# EAGLE design eagle exp 2 (EAGLE 9.6.2)
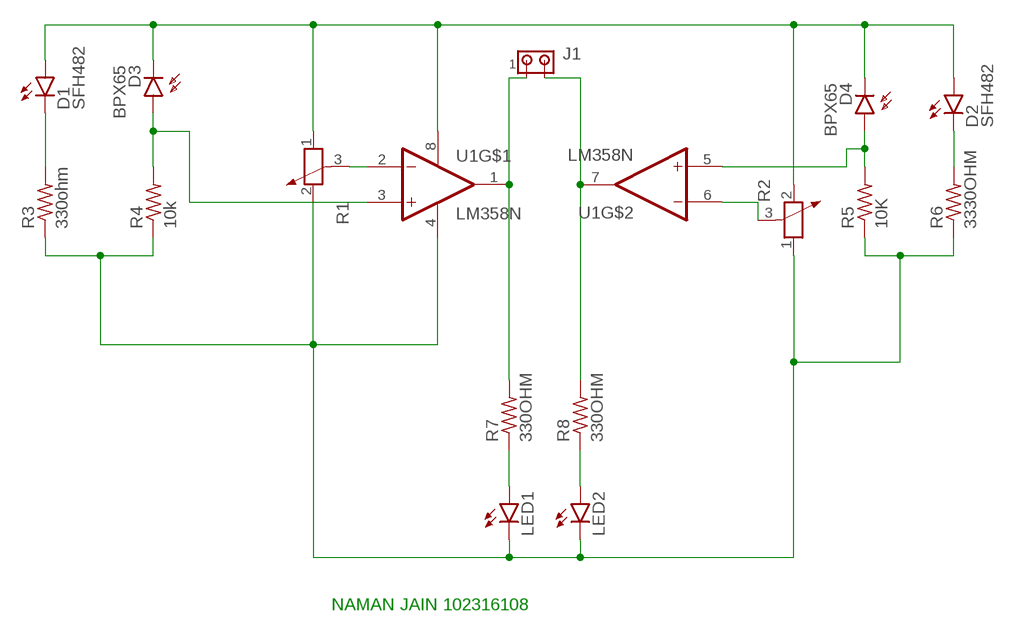
[diagram p0: schematic, sheet 1]

## Parts
D1  SFH482  [SFH482]
D2  SFH482  [SFH482]
D3  BPX65  [BPX65]
D4  BPX65  [BPX65]
J1  MTA02-100  [10X02MTA]
LED1  LED3MM  [LED3MM]
LED2  LED3MM  [LED3MM]
R1  POTENTIOMETER_PT-10  [PT-10]
R2  POTENTIOMETER_PT-10  [PT-10]
R3  330ohm  R-US_0204/5  [0204/5]
R4  10k  R-US_0204/5  [0204/5]
R5  10K  R-US_0204/5  [0204/5]
R6  3330OHM  R-US_0204/5  [0204/5]
R7  330OHM  R-US_0204/5  [0204/5]
R8  330OHM  R-US_0204/5  [0204/5]
U1  LM358N  [DIP762W46P254L960H508Q8]

## Nets
N$1: R1.3 U1.2(1IN-)
N$2: D1.K(C) R3.2
N$3: D2.K(C) R6.2
N$4: D4.A R5.2 U1.5(2IN+)
N$5: LED1.K(C) LED2.K(C) R1.2 R2.1 R3.1 R4.1 R5.1 R6.1 U1.4(GND)
N$6: R2.3 U1.6(2IN-)
N$7: D1.A D2.A D3.K(C) D4.K(C) R1.1 R2.2 U1.8(VCC)
N$8: J1.1 R7.2 U1.1(1OUT)
N$9: J1.2 R8.2 U1.7(2OUT)
N$10: LED1.A R7.1
N$11: LED2.A R8.1
N$13: D3.A R4.2 U1.3(1IN+)

## Notes on the sheet
- NAMAN JAIN 102316108

## Library data of the parts
D1 D2 = led:SFH482: IR LED infrared emitting diode, Infineon
D3 D4 = opto-trans-siemens:BPX65: PHOTO DIODE; MPN: BPX65.; OC_FARNELL: 327451; OC_NEWARK: 06WX2764
J1 = con-amp:MTA02-100: AMP connector
LED1 LED2 = led:LED: LED OSRAM: - CHIPLED LG R971, LG N971, LY N971, LG Q971, LY Q971, LO R971, LY R971 LH N974, LH R974 LS Q976, LO Q976, LY Q976 LO Q996 - Hyper CHIPLED LW Q18S LB Q993, LB Q99A, LB R99A - SideLED LS A670, LO A670, LY A670, LG A670, LP A670 LB A673, LV A673, LT A673, LW A673 LH A674 LY A675 LS A676, LA A676, LO A676, LY A676, LW A676 LS A679, LY A679, LG A679 - Hyper Micro SIDELED® LS Y876, LA Y876, LO Y876, LY Y876 LT Y87S - SmartLED LW L88C, LW L88S LB L89C, LB L89S, LG L890 LS L89K, LO L89K, LY L89K LS L896, LA L896, LO L896, LY L896 - TOPLED LS T670, LO T670, LY T670, LG T670, LP T670 LSG T670, LSP T670, LSY T670, LOP T670, LYG T670 LG T671, LOG T671, LSG T671 LB T673, LV T673, LT T673, LW T673 LH T674 LS T676, LA T676, LO T676, LY T676, LB T676, LH T676, LSB T676, LW T676 LB T67C, LV T67C, LT T67C, LS T67K, LO T67K, LY T67K, LW E67C LS E67B, LA E67B, LO E67B, LY E67B, LB E67C, LV E67C, LT E67C LW T67C LS T679, LY T679, LG T679 LS T770, LO T770, LY T770, LG T770, LP T770 LB T773, LV T773, LT T773, LW T773 LH T774 LS E675, LA E675, LY E675, LS T675 LS T776, LA T776, LO T776, LY T776, LB T776 LHGB T686 LT T68C, LB T68C - Hyper Mini TOPLED® LB M676 - Mini TOPLED Santana® LG M470 LS M47K, LO M47K, LY M47K Source: http://www.osram.convergy.de LUXEON: - LUMILED® LXK2-PW12-R00, LXK2-PW12-S00, LXK2-PW14-U00, LXK2-PW14-V00 LXK2-PM12-R00, LXK2-PM12-S00, LXK2-PM14-U00 LXK2-PE12-Q00, LXK2-PE12-R00, LXK2-PE12-S00, LXK2-PE14-T00, LXK2-PE14-U00 LXK2-PB12-K00, LXK2-PB12-L00, LXK2-PB12-M00, LXK2-PB14-N00, LXK2-PB14-P00, LXK2-PB14-Q00 LXK2-PR12-L00, LXK2-PR12-M00, LXK2-PR14-Q00, LXK2-PR14-R00 LXK2-PD12-Q00, LXK2-PD12-R00, LXK2-PD12-S00 LXK2-PH12-R00, LXK2-PH12-S00 LXK2-PL12-P00, LXK2-PL12-Q00, LXK2-PL12-R00 Source: www.luxeon.com KINGBRIGHT: KA-3528ASYC Source: www.kingbright.com
R1 R2 = rcl:POTENTIOMETER_: Potentiometer; SPICEMODEL: POT; SPICEPREFIX: X
R3-R8 = rcl:R-US_: RESISTOR, American symbol; SPICEPREFIX: R
U1 = LM358N:LM358N: IC OPAMP GP 2 CIRCUIT 8DIP Check availability <https://pricing.snapeda.com/parts/LM358N/Harris%20Corporation/view-part?ref=eda>; AVAILABILITY: Not in stock; CHECK_PRICES: https://www.snapeda.com/parts/LM358N/Harris/view-part/?ref=eda; DESCRIPTION: General Purpose Amplifier 2 Circuit 8-PDIP; MF: Harris Corporation; MP: LM358N; PACKAGE: None; PRICE: None; SNAPEDA_LINK: https://www.snapeda.com/parts/LM358N/Harris/view-part/?ref=snap

## Board
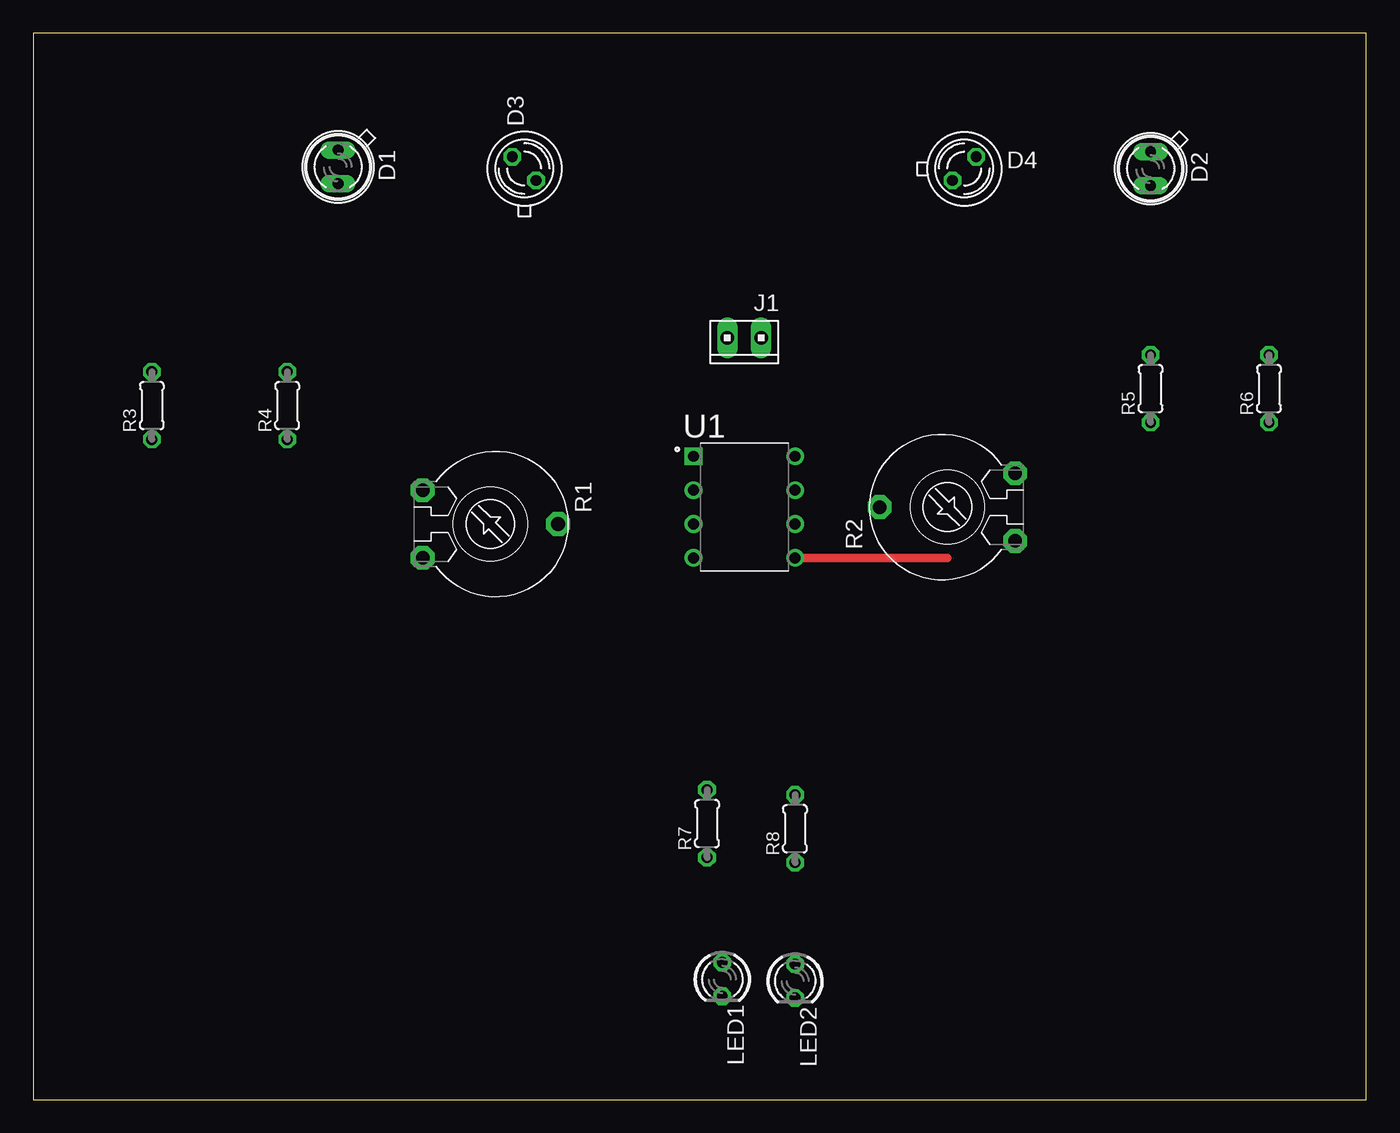
[diagram p1: board, top side]
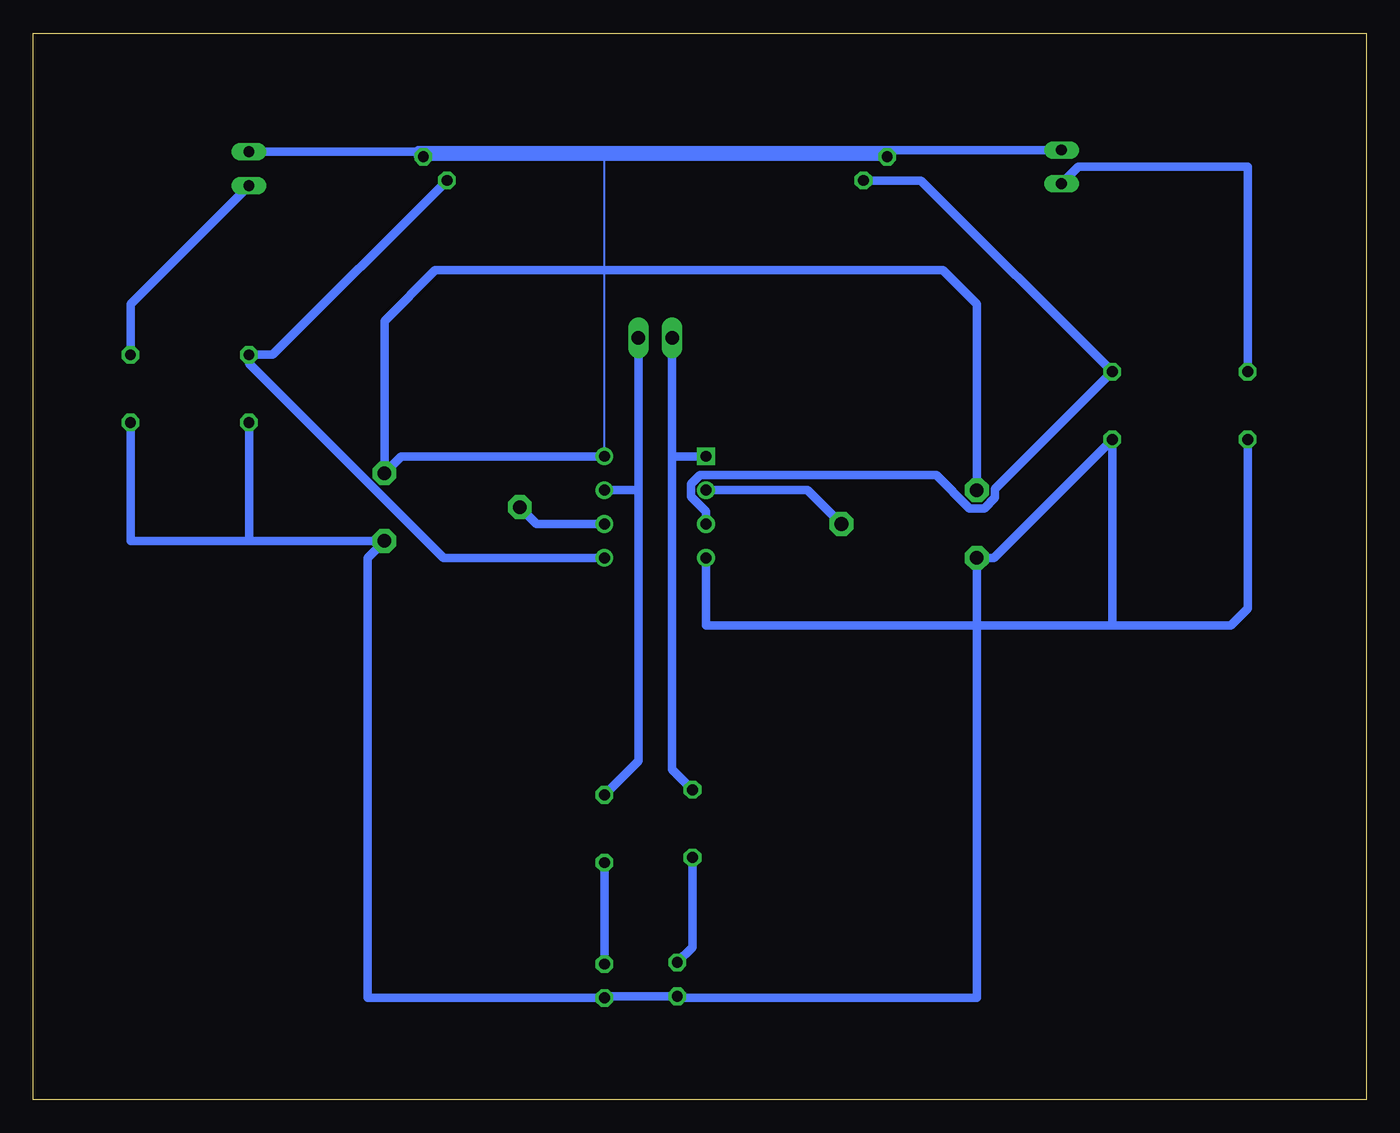
[diagram p2: board, bottom side, seen from below]

Size 100 x 80 mm. Coordinates in mm from the lower left corner, seen from the top.
Outline: 0,0 100,0 100,80 0,80 0,0
Copper layers (1*16): Top 0.035mm / dielectric 1.5mm / Bottom 0.035mm
Design rules "default": minimum track width 6mil, minimum drill 0.35mm, track to track 6mil, track to pad 6mil, pad to pad 6mil, via to via 6mil, smd to smd 6mil, copper to edge 40mil, drill to drill 6mil, minimum pad ring 10mil, minimum via ring 8mil, stop-mask expansion 4mil, vias tented up to drill 0mil, thermal gap 10mil

### Footprints (pad centres in the part's own frame; a part is rotated, then mirrored left to right if it is on the bottom)
SFH482 = drill 0.813 long: A -1.27,0; K 1.27,0
BPX65 = drill 0.813 octagon: A -0.889,-0.889; K 0.889,0.889
10X02MTA = drill 1.016 long: 1 1.27,0; 2 -1.27,0
LED3MM = drill 0.813 octagon: A -1.27,0; K 1.27,0
PT-10 = drill 1.016 pad 1.778 octagon: 1 -2.54,-5.08; 2 2.54,-5.08; 3 0,5.08
0204/5 = drill 0.813 octagon: 1 -2.54,0; 2 2.54,0
DIP762W46P254L960H508Q8 = drill 0.81 pad 1.22 square: 1 -3.81,3.81 | drill 0.81 pad 1.22: 2 -3.81,1.27; 3 -3.81,-1.27; 4 -3.81,-3.81; 5 3.81,-3.81; 6 3.81,-1.27; 7 3.81,1.27; 8 3.81,3.81

### Placement (x,y rotation side)
D1  22.86,69.98 270 top
D2  83.82,69.85 270 top
D3  36.83,69.85 90 top
D4  69.85,69.85 0 top
J1  53.34,57.15 180 top
LED1  51.69,9.02 270 top
LED2  57.15,8.89 270 top
R1  34.29,43.18 270 top
R2  68.58,44.45 90 top
R3  8.89,52.07 90 top
R4  19.05,52.07 90 top
R5  83.82,53.34 90 top
R6  92.71,53.34 90 top
R7  50.55,20.7 90 top
R8  57.15,20.32 90 top
U1  53.34,44.45 0 top

### Tracks (layer width: path | path; a pad name or v marks a point on that pad's centre or on a via)
N$1
  Bottom 0.635: R1.3 41.91,45.72 U1.2
N$2
  Bottom 0.635: R3.2 8.89,69.98 21.59,69.98 D1.K
N$3
  Bottom 0.635: R6.2 92.71,59.69 D2.K
N$4
  Top 0.635: U1.5 68.58,40.64
  Bottom 0.635: U1.5 69.23,40.64 83.82,55.23 R5.2 82.04,55.88 D4.A
N$5
  Bottom 0.152: R2.1 83.82,41.91 92.71,41.91 | 51.82,7.62 LED1.K
  Bottom 0.635: 19.05,35.56 R4.1 27.94,40.64 R1.2 29.21,7.62 51.82,7.62 | U1.4 49.53,35.56 19.05,35.56 | R3.1 8.89,36.83 10.16,35.56 19.05,35.56 | R5.1 83.82,41.91 | R6.1 92.71,41.91 R2.1 74.93,40.64 74.93,7.62 LED2.K 57.02,7.75 LED1.K
N$6
  Bottom 0.635: U1.6 62.23,43.18 R2.3
N$7
  Bottom 0.152: D1.A 35.43,71.25 D3.K | D3.K 36.32,71.12 | D3.K 57.15,70.74 | 57.15,70.74 D4.K | U1.8 57.15,70.74
  Bottom 0.635: D1.A 71.12,71.25 71.12,71.12 | D4.K 71.12,70.74 71.12,71.12 | R1.1 29.21,59.69 31.75,62.23 69.85,62.23 73.66,58.42 R2.2 72.39,48.26 U1.8 | D3.K D4.K | D4.K 71.12,71.12 | 71.12,71.12 D2.A
N$8
  Bottom 0.635: R7.2 52.07,24.77 52.07,25.4 52.07,48.26 | J1.1 52.07,48.26 | U1.1 52.07,48.26
N$9
  Bottom 0.635: J1.2 54.61,45.72 | 54.61,45.72 54.61,26.67 54.61,25.4 R8.2 | U1.7 54.61,45.72
N$10
  Bottom 0.635: R7.1 50.55,11.43 LED1.A
N$11
  Bottom 0.635: R8.1 LED2.A
N$13
  Bottom 0.152: U1.3 49.53,44.47 50.42,45.35 50.42,46.09 49.9,46.61 49.53,46.61
  Bottom 0.635: D3.A 33.4,68.96 R4.2 27.85,45.81 27.85,45.16 28.65,44.36 29.77,44.36 32.26,46.85 50,46.85 50.66,46.19 50.66,45.25 49.53,44.12 U1.3